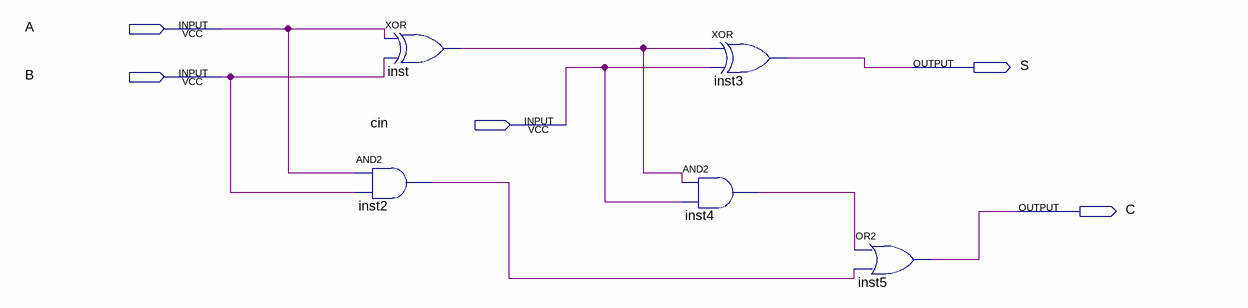
[diagram p0: schematic sheet]
// Quartus schematic celula.bdf as structural Verilog: 5 symbols, 5 pins
module celula (
  input  A,
  input  B,
  input  cin,
  output S,
  output C
);

  wire inst2_out, inst4_out, inst_out;

  and inst2 (inst2_out, A, B);
  xor inst (inst_out, A, B);
  and inst4 (inst4_out, inst_out, cin);
  xor inst3 (S, inst_out, cin);
  or inst5 (C, inst4_out, inst2_out);
endmodule
